# Altium schematic sheet THS4524_Fully_Diff.SchDoc
size A3; Organization: Altium Limited; Address1: L3, 12a Rodborough Rd; Address2: Frenchs Forest; Address3: NSW; Address4: Australia 2086
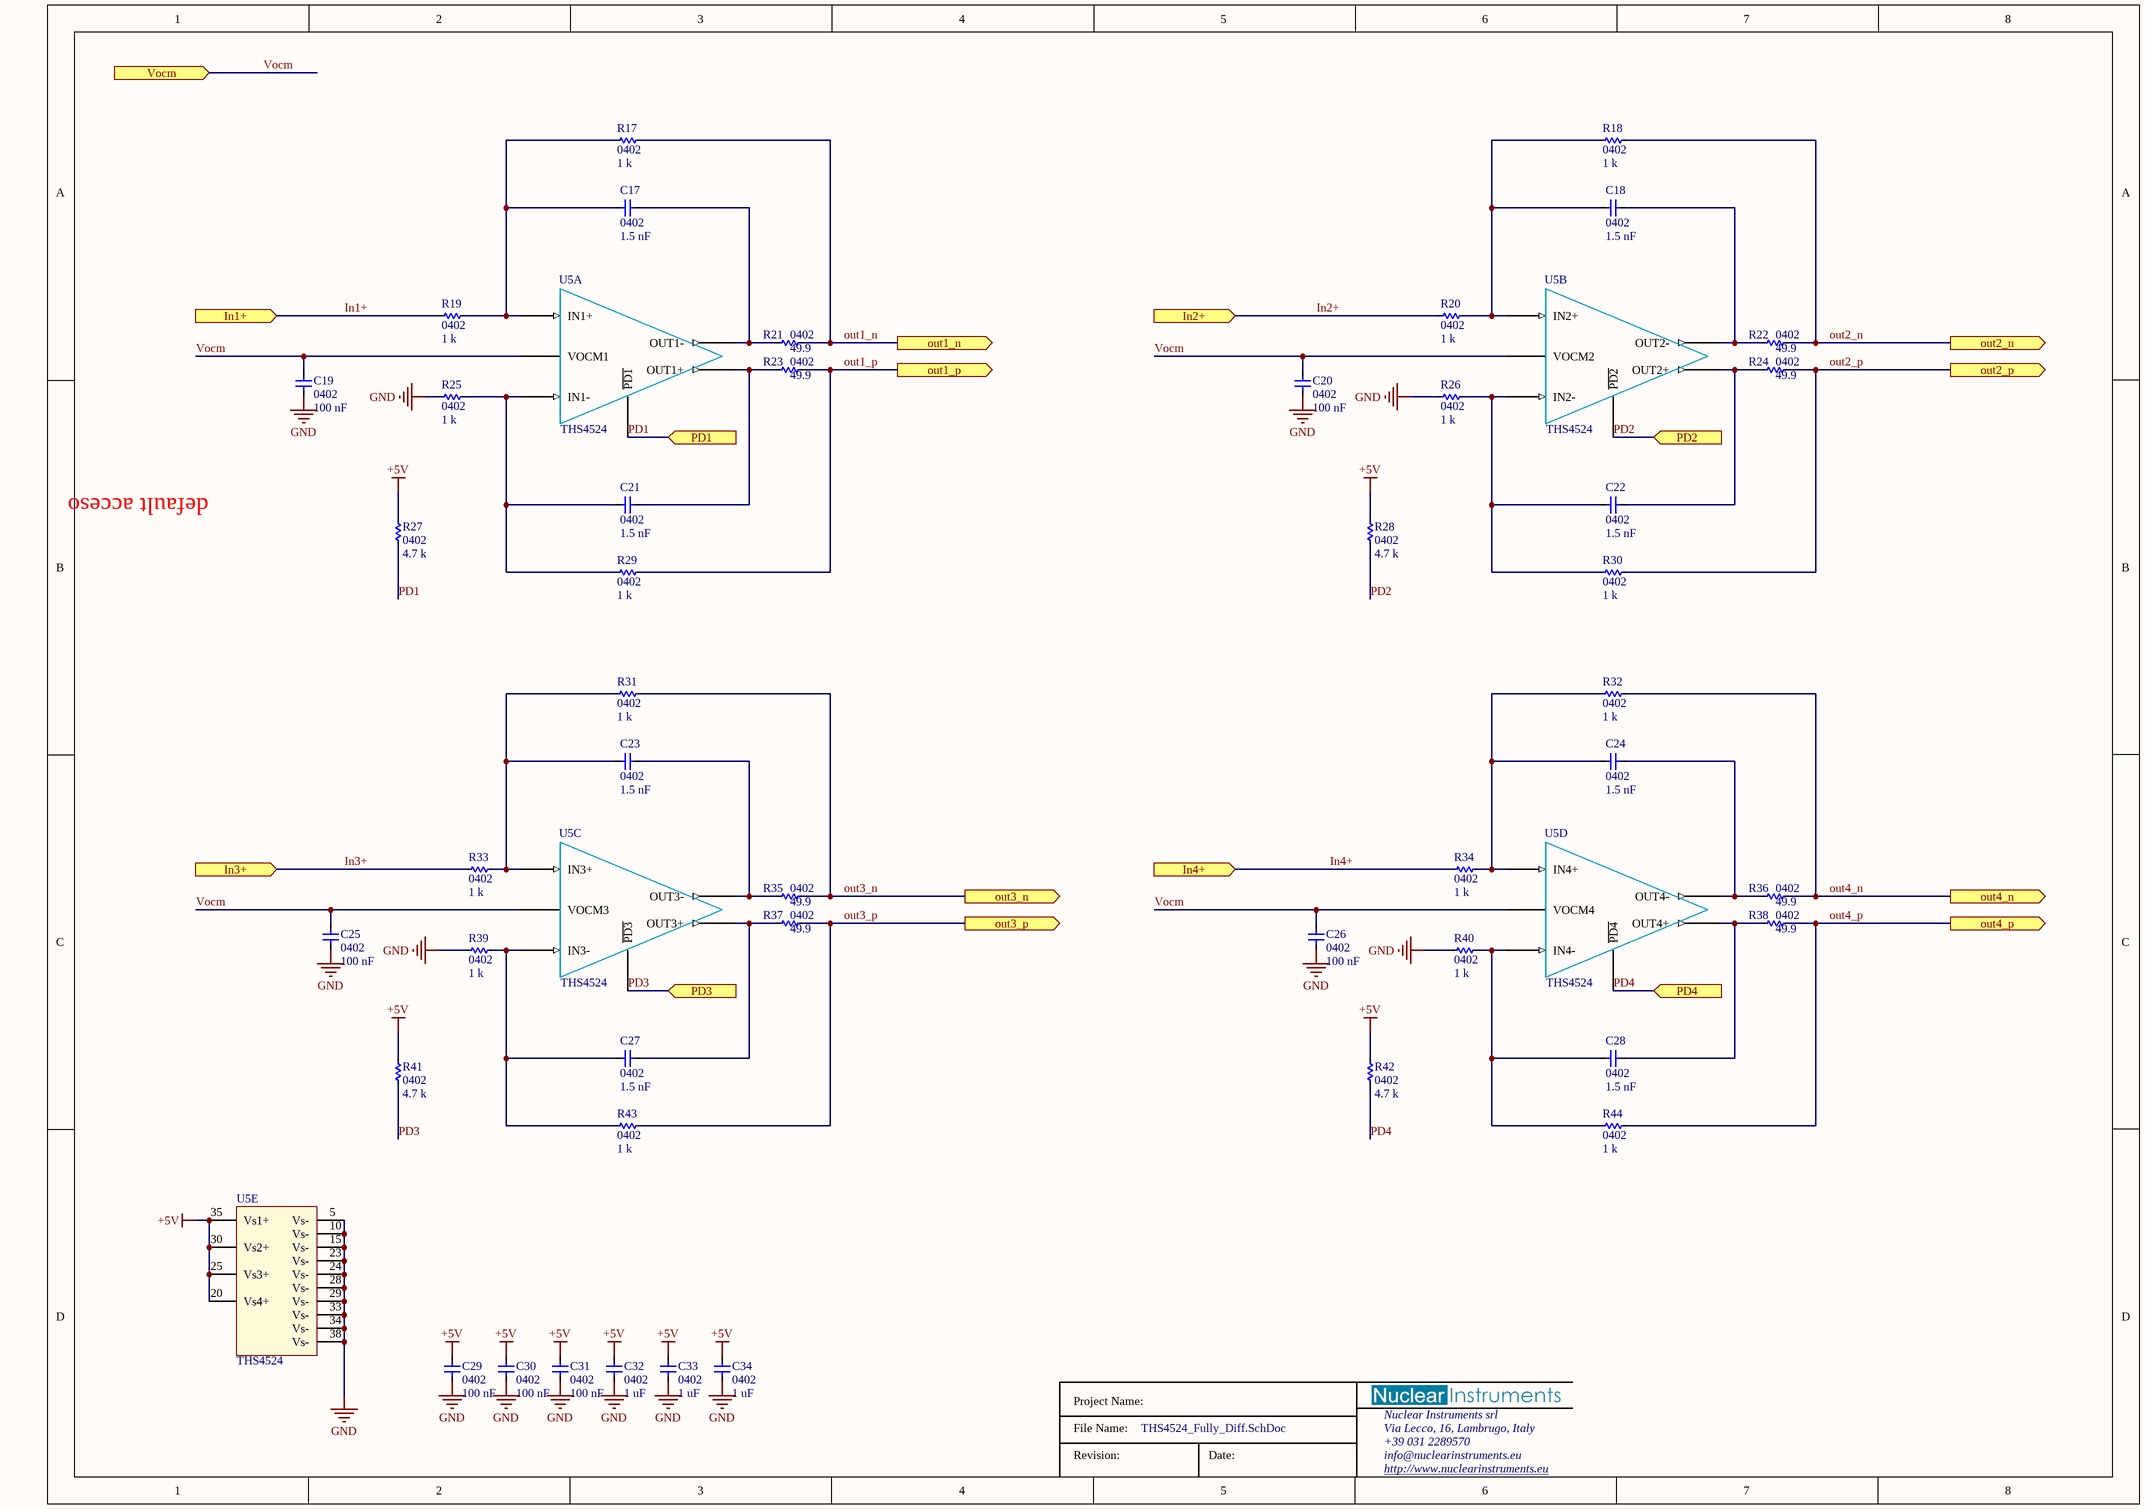
[diagram p0: THS4524_Fully_Diff.SchDoc]

## Parts
C17  0402  value 1.5 nF  [CAPCERSMD0402]
C18  0402  value 1.5 nF  [CAPCERSMD0402]
C19  0402  value 100 nF  [CAPCERSMD0402]
C20  0402  value 100 nF  [CAPCERSMD0402]
C21  0402  value 1.5 nF  [CAPCERSMD0402]
C22  0402  value 1.5 nF  [CAPCERSMD0402]
C23  0402  value 1.5 nF  [CAPCERSMD0402]
C24  0402  value 1.5 nF  [CAPCERSMD0402]
C25  0402  value 100 nF  [CAPCERSMD0402]
C26  0402  value 100 nF  [CAPCERSMD0402]
C27  0402  value 1.5 nF  [CAPCERSMD0402]
C28  0402  value 1.5 nF  [CAPCERSMD0402]
C29  0402  value 100 nF  [CAPCERSMD0402]
C30  0402  value 100 nF  [CAPCERSMD0402]
C31  0402  value 100 nF  [CAPCERSMD0402]
C32  0402  value 1 uF  [CAPCERSMD0402]
C33  0402  value 1 uF  [CAPCERSMD0402]
C34  0402  value 1 uF  [CAPCERSMD0402]
R17  0402  value 1 k  [RESSMD0402]
R18  0402  value 1 k  [RESSMD0402]
R19  0402  value 1 k  [RESSMD0402]
R20  0402  value 1 k  [RESSMD0402]
R21  0402  value 49.9  [RESSMD0402]
R22  0402  value 49.9  [RESSMD0402]
R23  0402  value 49.9  [RESSMD0402]
R24  0402  value 49.9  [RESSMD0402]
R25  0402  value 1 k  [RESSMD0402]
R26  0402  value 1 k  [RESSMD0402]
R27  0402  value 4.7 k  [RESSMD0402]
R28  0402  value 4.7 k  [RESSMD0402]
R29  0402  value 1 k  [RESSMD0402]
R30  0402  value 1 k  [RESSMD0402]
R31  0402  value 1 k  [RESSMD0402]
R32  0402  value 1 k  [RESSMD0402]
R33  0402  value 1 k  [RESSMD0402]
R34  0402  value 1 k  [RESSMD0402]
R35  0402  value 49.9  [RESSMD0402]
R36  0402  value 49.9  [RESSMD0402]
R37  0402  value 49.9  [RESSMD0402]
R38  0402  value 49.9  [RESSMD0402]
R39  0402  value 1 k  [RESSMD0402]
R40  0402  value 1 k  [RESSMD0402]
R41  0402  value 4.7 k  [RESSMD0402]
R42  0402  value 4.7 k  [RESSMD0402]
R43  0402  value 1 k  [RESSMD0402]
R44  0402  value 1 k  [RESSMD0402]
U5  THS4524  [SOP38_P50W640L970H120]  (parts A,B,C,D,E of 5)

## Ports
In1+ (in), In2+ (in), In3+ (in), In4+ (in), out1_n (out), out1_p (out), out2_n (out), out2_p (out), out3_n (out), out3_p (out), out4_n (out), out4_p (out), PD1 (in), PD2 (in), PD3 (in), PD4 (in), Vocm (in)

## Nets
+5V: C29.2 C30.2 C31.2 C32.2 C33.2 C34.2 R27.1 R28.1 R41.1 R42.1 U5.20(Vs4+) U5.25(Vs3+) U5.30(Vs2+) U5.35(Vs1+)
GND: C19.1 C20.1 C25.1 C26.1 C29.1 C30.1 C31.1 C32.1 C33.1 C34.1 R25.1 R26.1 R39.1 R40.1 U5.5(Vs-) U5.10(Vs-) U5.15(Vs-) U5.23(Vs-) U5.24(Vs-) U5.28(Vs-) U5.29(Vs-) U5.33(Vs-) U5.34(Vs-) U5.38(Vs-)
In1+: R19.1 ; port In1+
In2+: R20.1 ; port In2+
In3+: R33.1 ; port In3+
In4+: R34.1 ; port In4+
out1_n: R17.2 R21.2 ; port out1_n
out1_p: R23.2 R29.2 ; port out1_p
out2_n: R18.2 R22.2 ; port out2_n
out2_p: R24.2 R30.2 ; port out2_p
out3_n: R31.2 R35.2 ; port out3_n
out3_p: R37.2 R43.2 ; port out3_p
out4_n: R32.2 R36.2 ; port out4_n
out4_p: R38.2 R44.2 ; port out4_p
PD1: R27.2 U5.1(~{PD1}) ; port PD1
PD2: R28.2 U5.6(~{PD2}) ; port PD2
PD3: R41.2 U5.11(~{PD3}) ; port PD3
PD4: R42.2 U5.16(~{PD4}) ; port PD4
Vocm: C19.2 C20.2 C25.2 C26.2 U5.4(VOCM1) U5.9(VOCM2) U5.14(VOCM3) U5.19(VOCM4) ; port Vocm
NetC17_1: C17.1 R21.1 U5.37(OUT1-)
NetC17_2: C17.2 R17.1 R19.2 U5.2(IN1+)
NetC18_1: C18.1 R22.1 U5.32(OUT2-)
NetC18_2: C18.2 R18.1 R20.2 U5.7(IN2+)
NetC21_1: C21.1 R23.1 U5.36(OUT1+)
NetC21_2: C21.2 R25.2 R29.1 U5.3(IN1-)
NetC22_1: C22.1 R24.1 U5.31(OUT2+)
NetC22_2: C22.2 R26.2 R30.1 U5.8(IN2-)
NetC23_1: C23.1 R35.1 U5.27(OUT3-)
NetC23_2: C23.2 R31.1 R33.2 U5.12(IN3+)
NetC24_1: C24.1 R36.1 U5.22(OUT4-)
NetC24_2: C24.2 R32.1 R34.2 U5.17(IN4+)
NetC27_1: C27.1 R37.1 U5.26(OUT3+)
NetC27_2: C27.2 R39.2 R43.1 U5.13(IN3-)
NetC28_1: C28.1 R38.1 U5.21(OUT4+)
NetC28_2: C28.2 R40.2 R44.1 U5.18(IN4-)

## Notes on the sheet
- (near R27) default acceso
- Project Name:
- Revision:
- File Name:
- Date:
- Nuclear Instruments srl
- Via Lecco, 16, Lambrugo, Italy
- +39 031 2289570
- info@nuclearinstruments.eu
- http://www.nuclearinstruments.eu

## Library data of the parts
C17 C18 C21-C24 C27 C28 = CAPCER0402_X7R_50V_1n5: NICode: 00650002879; NIClass: Standard
C19 C20 C25 C26 C29-C31 = CAPCER0402_X7R_50V_100n: NICode: 00650000173; NIClass: Standard
C32-C34 = CAPCER0402_X5R_10V_1u: NICode: 00650000182; NIClass: Standard
R17-R20 R25 R26 R29-R34 R39 R40 R43 R44 = RES0402-1k: NICode: 00300000046; NIClass: Standard
R21-R24 R35-R38 = RES0402-49R9: NICode: 00300000035; NIClass: Standard
R27 R28 R41 R42 = RES0402-4k7: NICode: 00300000057; NIClass: Standard
U5 = THS4524IDBTR: NICode: 00890002878; NIClass: Standard